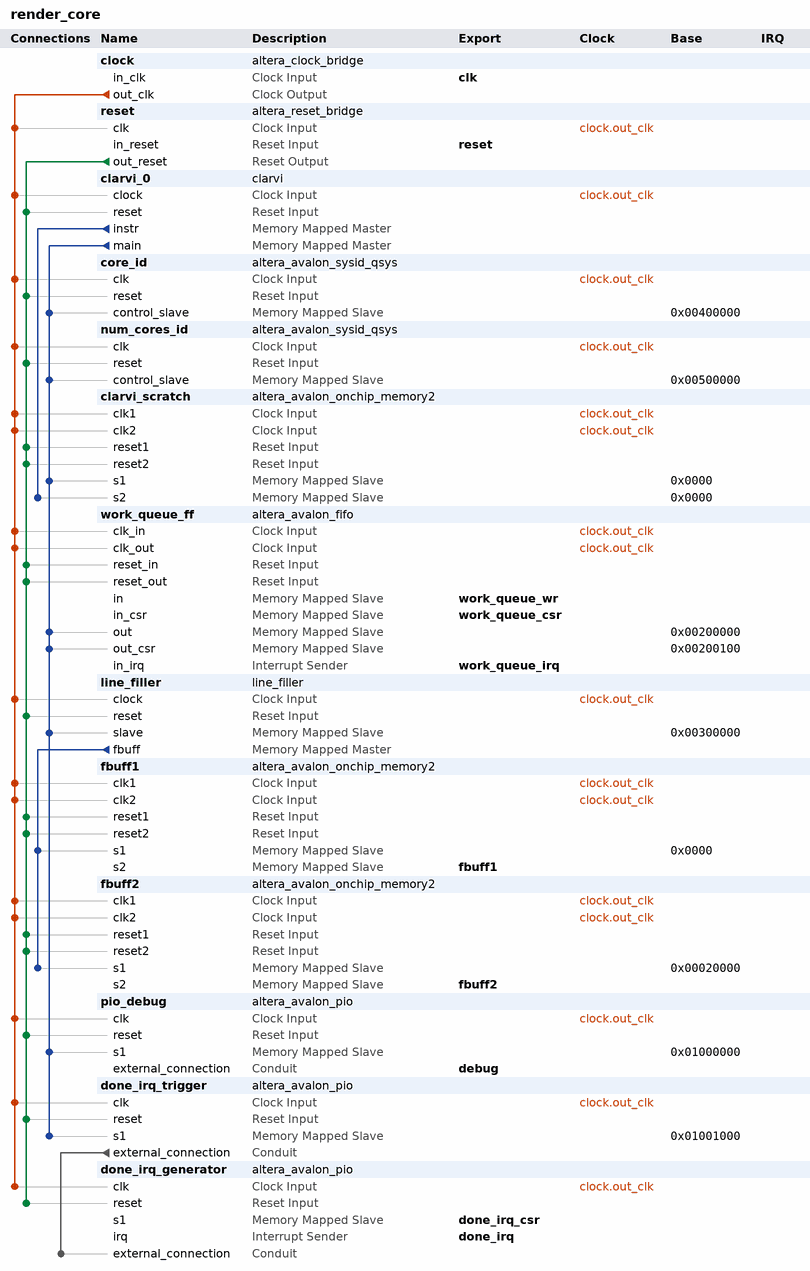
[diagram p0: system contents]
# Platform Designer (Qsys) system render_core, Cyclone V 5CSEMA5F31C6
# Parameters at their usual value, and those the tool derives, are not listed.
package require -exact qsys 16.0
create_system render_core
set_project_property DEVICE_FAMILY {Cyclone V}
set_project_property DEVICE 5CSEMA5F31C6

add_instance clock altera_clock_bridge 16.0
set_instance_parameter_value clock DERIVED_CLOCK_RATE 0
set_instance_parameter_value clock EXPLICIT_CLOCK_RATE 0

add_instance reset altera_reset_bridge 16.0
set_instance_parameter_value reset ACTIVE_LOW_RESET 0
set_instance_parameter_value reset SYNCHRONOUS_EDGES deassert

add_instance clarvi_0 clarvi 1.0
set_instance_parameter_value clarvi_0 DATA_ADDR_WIDTH 29
set_instance_parameter_value clarvi_0 DEFAULT_TRAP_VECTOR 0
set_instance_parameter_value clarvi_0 INITIAL_PC 0
set_instance_parameter_value clarvi_0 INSTR_ADDR_WIDTH 29

add_instance core_id altera_avalon_sysid_qsys 16.0
set_instance_parameter_value core_id id 0

add_instance num_cores_id altera_avalon_sysid_qsys 16.0
set_instance_parameter_value num_cores_id id 0

add_instance clarvi_scratch altera_avalon_onchip_memory2 16.0
set_instance_parameter_value clarvi_scratch dataWidth 32
set_instance_parameter_value clarvi_scratch dualPort true
set_instance_parameter_value clarvi_scratch initMemContent true
set_instance_parameter_value clarvi_scratch initializationFileName mem.hex
set_instance_parameter_value clarvi_scratch memorySize 4096
set_instance_parameter_value clarvi_scratch useNonDefaultInitFile true

add_instance work_queue_ff altera_avalon_fifo 16.0
set_instance_parameter_value work_queue_ff bitsPerSymbol 16
set_instance_parameter_value work_queue_ff channelWidth 8
set_instance_parameter_value work_queue_ff errorWidth 8
set_instance_parameter_value work_queue_ff fifoDepth 128
set_instance_parameter_value work_queue_ff fifoInputInterfaceOptions AVALONMM_WRITE
set_instance_parameter_value work_queue_ff fifoOutputInterfaceOptions AVALONMM_READ
set_instance_parameter_value work_queue_ff singleClockMode false
set_instance_parameter_value work_queue_ff symbolsPerBeat 2
set_instance_parameter_value work_queue_ff useIRQ true
set_instance_parameter_value work_queue_ff usePacket true
set_instance_parameter_value work_queue_ff useReadControl true

add_instance line_filler line_filler 1.0

add_instance fbuff1 altera_avalon_onchip_memory2 16.0
set_instance_parameter_value fbuff1 dataWidth 32
set_instance_parameter_value fbuff1 dualPort true
set_instance_parameter_value fbuff1 initMemContent true
set_instance_parameter_value fbuff1 initializationFileName onchip_mem.hex
set_instance_parameter_value fbuff1 memorySize 16320

add_instance fbuff2 altera_avalon_onchip_memory2 16.0
set_instance_parameter_value fbuff2 dataWidth 32
set_instance_parameter_value fbuff2 dualPort true
set_instance_parameter_value fbuff2 initMemContent true
set_instance_parameter_value fbuff2 initializationFileName onchip_mem.hex
set_instance_parameter_value fbuff2 memorySize 16320

add_instance pio_debug altera_avalon_pio 16.0
set_instance_parameter_value pio_debug direction Output
set_instance_parameter_value pio_debug width 8

add_instance done_irq_trigger altera_avalon_pio 16.0
set_instance_parameter_value done_irq_trigger direction Output
set_instance_parameter_value done_irq_trigger width 1

add_instance done_irq_generator altera_avalon_pio 16.0
set_instance_parameter_value done_irq_generator captureEdge true
set_instance_parameter_value done_irq_generator direction Input
set_instance_parameter_value done_irq_generator generateIRQ true
set_instance_parameter_value done_irq_generator irqType EDGE
set_instance_parameter_value done_irq_generator width 1

# connections
add_connection clock.out_clk clarvi_0.clock clock
add_connection clock.out_clk clarvi_scratch.clk1 clock
add_connection clock.out_clk clarvi_scratch.clk2 clock
add_connection clock.out_clk core_id.clk clock
add_connection clock.out_clk done_irq_generator.clk clock
add_connection clock.out_clk done_irq_trigger.clk clock
add_connection clock.out_clk fbuff1.clk1 clock
add_connection clock.out_clk fbuff1.clk2 clock
add_connection clock.out_clk fbuff2.clk1 clock
add_connection clock.out_clk fbuff2.clk2 clock
add_connection clock.out_clk line_filler.clock clock
add_connection clock.out_clk num_cores_id.clk clock
add_connection clock.out_clk pio_debug.clk clock
add_connection clock.out_clk reset.clk clock
add_connection clock.out_clk work_queue_ff.clk_in clock
add_connection clock.out_clk work_queue_ff.clk_out clock
add_connection reset.out_reset clarvi_0.reset reset
add_connection reset.out_reset clarvi_scratch.reset1 reset
add_connection reset.out_reset clarvi_scratch.reset2 reset
add_connection reset.out_reset core_id.reset reset
add_connection reset.out_reset done_irq_generator.reset reset
add_connection reset.out_reset done_irq_trigger.reset reset
add_connection reset.out_reset fbuff1.reset1 reset
add_connection reset.out_reset fbuff1.reset2 reset
add_connection reset.out_reset fbuff2.reset1 reset
add_connection reset.out_reset fbuff2.reset2 reset
add_connection reset.out_reset line_filler.reset reset
add_connection reset.out_reset num_cores_id.reset reset
add_connection reset.out_reset pio_debug.reset reset
add_connection reset.out_reset work_queue_ff.reset_in reset
add_connection reset.out_reset work_queue_ff.reset_out reset
add_connection clarvi_0.instr clarvi_scratch.s2 avalon
set_connection_parameter_value clarvi_0.instr/clarvi_scratch.s2 baseAddress 0x0000
add_connection clarvi_0.main clarvi_scratch.s1 avalon
set_connection_parameter_value clarvi_0.main/clarvi_scratch.s1 baseAddress 0x0000
add_connection clarvi_0.main core_id.control_slave avalon
set_connection_parameter_value clarvi_0.main/core_id.control_slave baseAddress 0x00400000
add_connection clarvi_0.main done_irq_trigger.s1 avalon
set_connection_parameter_value clarvi_0.main/done_irq_trigger.s1 baseAddress 0x01001000
add_connection clarvi_0.main line_filler.slave avalon
set_connection_parameter_value clarvi_0.main/line_filler.slave baseAddress 0x00300000
add_connection clarvi_0.main num_cores_id.control_slave avalon
set_connection_parameter_value clarvi_0.main/num_cores_id.control_slave baseAddress 0x00500000
add_connection clarvi_0.main pio_debug.s1 avalon
set_connection_parameter_value clarvi_0.main/pio_debug.s1 baseAddress 0x01000000
add_connection clarvi_0.main work_queue_ff.out avalon
set_connection_parameter_value clarvi_0.main/work_queue_ff.out baseAddress 0x00200000
add_connection clarvi_0.main work_queue_ff.out_csr avalon
set_connection_parameter_value clarvi_0.main/work_queue_ff.out_csr baseAddress 0x00200100
add_connection line_filler.fbuff fbuff1.s1 avalon
set_connection_parameter_value line_filler.fbuff/fbuff1.s1 baseAddress 0x0000
add_connection line_filler.fbuff fbuff2.s1 avalon
set_connection_parameter_value line_filler.fbuff/fbuff2.s1 baseAddress 0x00020000
add_connection done_irq_trigger.external_connection done_irq_generator.external_connection conduit

# exported interfaces
add_interface clk clock sink
set_interface_property clk EXPORT_OF clock.in_clk
add_interface debug conduit end
set_interface_property debug EXPORT_OF pio_debug.external_connection
add_interface done_irq interrupt sender
set_interface_property done_irq EXPORT_OF done_irq_generator.irq
add_interface done_irq_csr avalon slave
set_interface_property done_irq_csr EXPORT_OF done_irq_generator.s1
add_interface fbuff1 avalon slave
set_interface_property fbuff1 EXPORT_OF fbuff1.s2
add_interface fbuff2 avalon slave
set_interface_property fbuff2 EXPORT_OF fbuff2.s2
add_interface reset reset sink
set_interface_property reset EXPORT_OF reset.in_reset
add_interface work_queue_csr avalon slave
set_interface_property work_queue_csr EXPORT_OF work_queue_ff.in_csr
add_interface work_queue_irq interrupt sender
set_interface_property work_queue_irq EXPORT_OF work_queue_ff.in_irq
add_interface work_queue_wr avalon slave
set_interface_property work_queue_wr EXPORT_OF work_queue_ff.in

set_interconnect_requirement {$system} qsys_mm.clockCrossingAdapter HANDSHAKE
set_interconnect_requirement {$system} qsys_mm.enableEccProtection FALSE
set_interconnect_requirement {$system} qsys_mm.insertDefaultSlave FALSE
set_interconnect_requirement {$system} qsys_mm.maxAdditionalLatency 1

save_system render_core.qsys
